# EAGLE design SparkFun_Digi_XBee_Regulated_Qwiic (EAGLE 9.6.2)
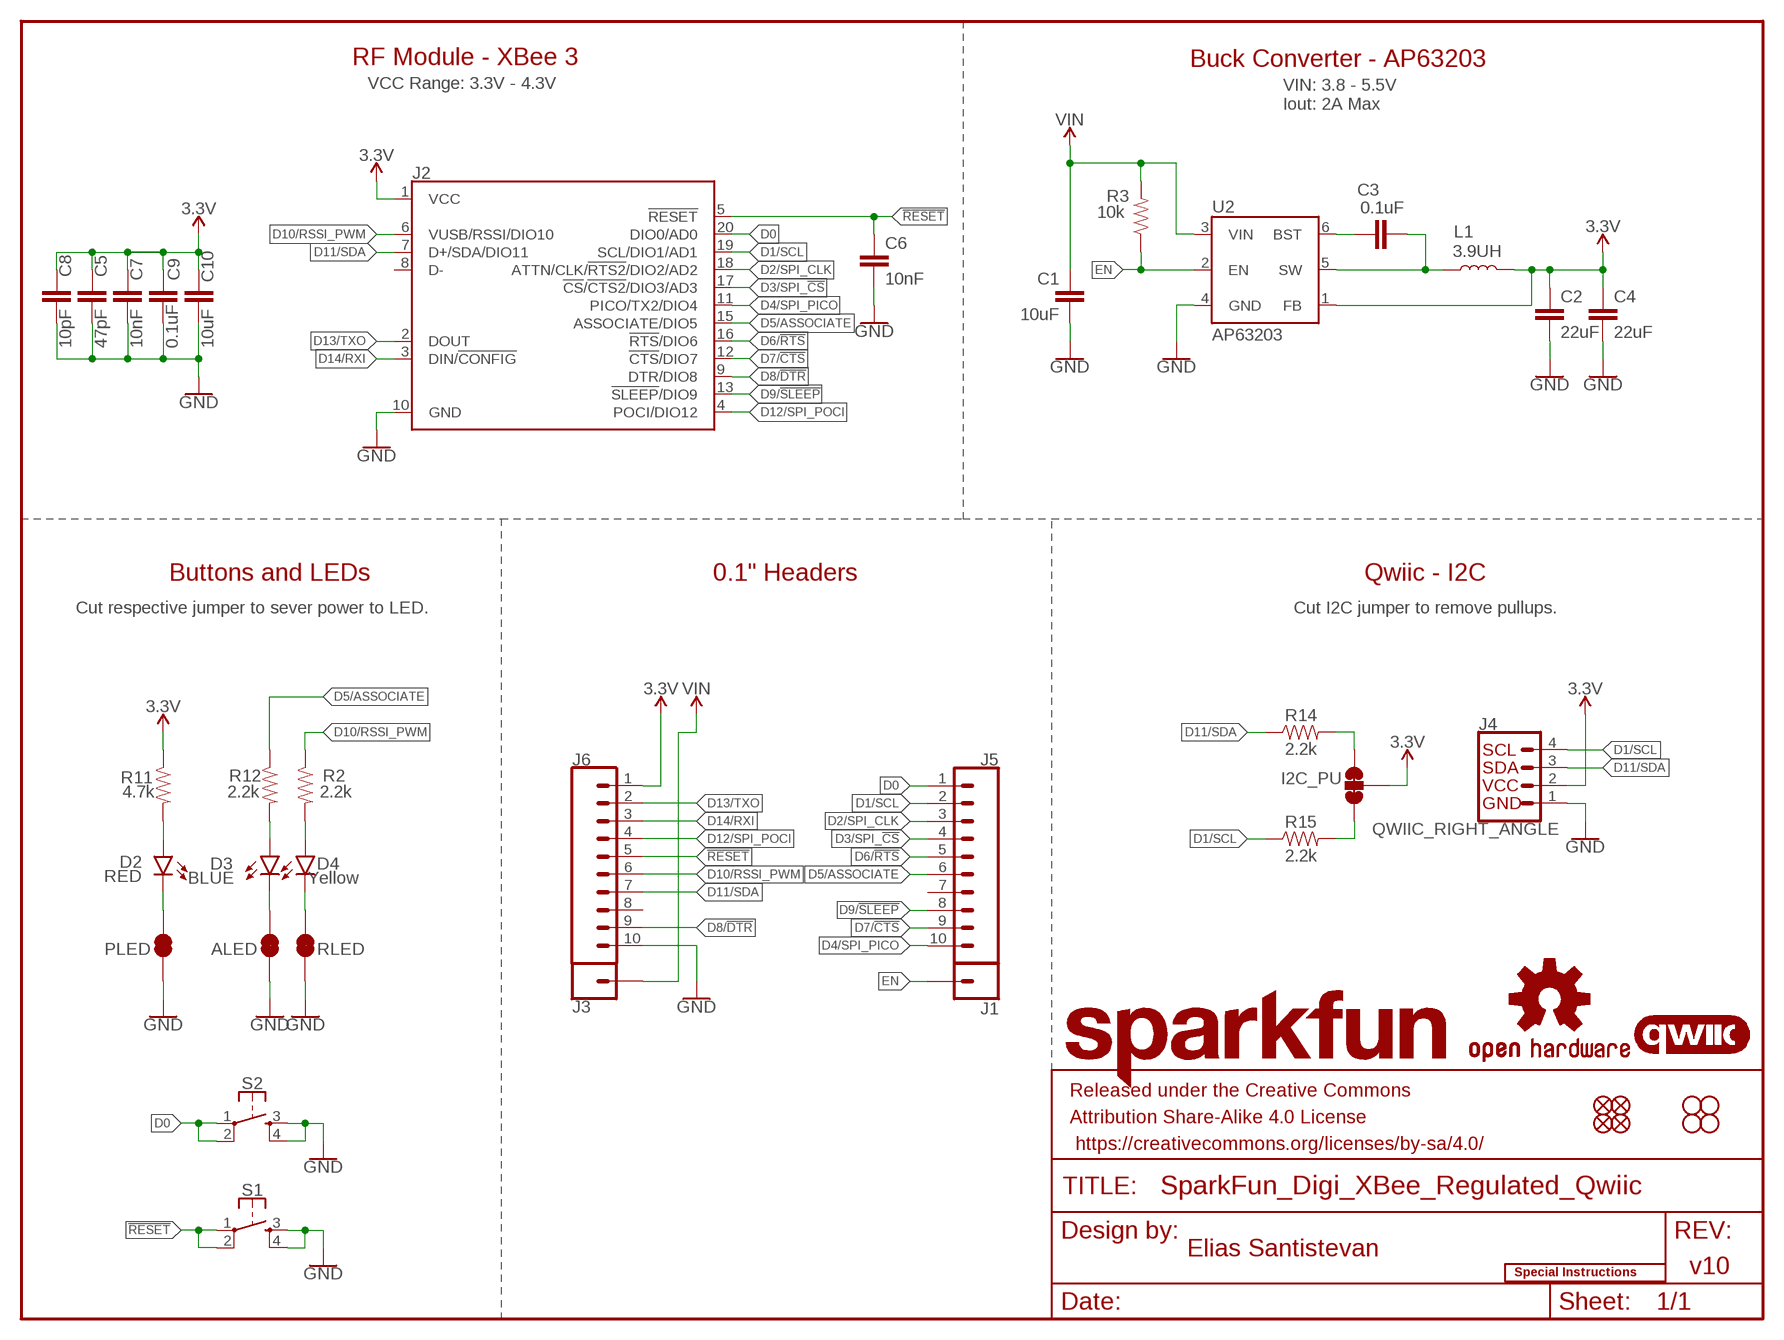
[diagram p0: schematic, sheet 1]

## Parts
ALED  JUMPER-SMT_2_NC_TRACE_SILK  [SMT-JUMPER_2_NC_TRACE_SILK]
C1  10uF  10UF-1210-50V-20%  [1210]
C2  22uF  22UF-0603-6.3V-20%  [0603]
C3  0.1uF  0.1UF-0603-25V-5%  [0603]
C4  22uF  22UF-0603-6.3V-20%  [0603]
C5  47pF  47PF-0603-50V-5%  [0603]
C6  10nF  10NF-0603-50V-10%  [0603]
C7  10nF  10NF-0603-50V-10%  [0603]
C8  10pF  10PF-0603-50V-5%  [0603]
C9  0.1uF  0.1UF-0603-25V-(+80/-20%)  [0603]
C10  10uF  10UF-0603-6.3V-20%  [0603]
D2  RED  LED-RED_0603-KB  [LED-0603]
D3  BLUE  LED-BLUE0603  [LED-0603]
D4  Yellow  LED-YELLOW0603  [LED-0603]
FD1  FIDUCIAL1X2  [FIDUCIAL-1X2]
FD2  FIDUCIAL1X2  [FIDUCIAL-1X2]
FD3  FIDUCIAL1X2  [FIDUCIAL-1X2]
FD4  FIDUCIAL1X2  [FIDUCIAL-1X2]
FRAME2  FRAME-LETTER  [CREATIVE_COMMONS]
H1  STAND-OFFTIGHT  [STAND-OFF-TIGHT]
H2  STAND-OFFTIGHT  [STAND-OFF-TIGHT]
H3  STAND-OFFTIGHT  [STAND-OFF-TIGHT]
H4  STAND-OFFTIGHT  [STAND-OFF-TIGHT]
I2C_PU  JUMPER-SMT_3_2-NC_TRACE_SILK  [SMT-JUMPER_3_2-NC_TRACE_SILK]
J1  CONN_01PTH_NO_SILK_STAND  [1X01_NO_SILK_STAND]
J2  XBEE_UPDATEXBEE_SMD  [XBEE3-SMD]
J3  CONN_01PTH_NO_SILK_STAND  [1X01_NO_SILK_STAND]
J4  QWIIC_RIGHT_ANGLE  QWIIC_CONNECTORJS-1MM  [JST04_1MM_RA]
J5  CONN_10NO_SILK_PTH_FEMALE  [1X10_NO_SILK]
J6  CONN_10NO_SILK_PTH_FEMALE  [1X10_NO_SILK]
L1  3.9UH  [INDUCTOR_3.9UH]
LOGO1  SPECIAL_INSTRUCTIONS-ORDERING  [ORDERING_INSTRUCTIONS]
LOGO2  OSHW-LOGOS  [OSHW-LOGO-S]
LOGO3  QWIIC_LOGO_4MM  [QWIIC_4MM]
LOGO4  SFE_LOGO_NAMEBLANK  [BLANK]
PLED  JUMPER-SMT_2_NC_TRACE_SILK  [SMT-JUMPER_2_NC_TRACE_SILK]
R2  2.2k  2.2KOHM-0603-1/10W-1%  [0603]
R3  10k  10KOHM-0603-1/10W-1%  [0603]
R11  4.7k  4.7KOHM-0603-1/10W-1%  [0603]
R12  2.2k  2.2KOHM-0603-1/10W-1%  [0603]
R14  2.2k  2.2KOHM-0603-1/10W-1%  [0603]
R15  2.2k  2.2KOHM-0603-1/10W-1%  [0603]
RLED  JUMPER-SMT_2_NC_TRACE_SILK  [SMT-JUMPER_2_NC_TRACE_SILK]
S1  MOMENTARY-SWITCH-SPST-2-SMD-5.2MM-TALL  [TACTILE_SWITCH_SMD_5.2MM]
S2  MOMENTARY-SWITCH-SPST-2-SMD-5.2MM-TALL  [TACTILE_SWITCH_SMD_5.2MM]
U2  AP63203  [SOT23-6]

## Nets
3.3V: C2.1 C4.1 C5.1 C7.1 C8.1 C9.1 C10.1 I2C_PU.2 J2.1(VCC) J4.2 J6.1 L1.P$2 R11.1 U2.1(FB)
!RESET!: C6.1 J2.5(!RESET!) J6.5 S1.1 S1.2
D0: J2.20(DIO0/AD0) J5.1 S2.1 S2.2
D1/SCL: J2.19(SCL/DIO1/AD1) J4.4 J5.2 R15.1
D2/SPI_CLK: J2.18(ATTN/CLK/!RTS2!/DIO2/AD2) J5.3
D3/SPI_!CS!: J2.17(!CS!/!CTS2!/DIO3/AD3) J5.4
D4/SPI_PICO: J2.11(PICO/TX2/DIO4) J5.10
D5/ASSOCIATE: J2.15(ASSOCIATE/DIO5) J5.6 R12.1
D6/!RTS!: J2.16(!RTS!/DIO6) J5.5
D7/!CTS!: J2.12(!CTS!/DIO7) J5.9
D8/!DTR!: J2.9(DTR/DIO8) J6.9
D9/!SLEEP!: J2.13(!SLEEP!/DIO9) J5.8
D10/RSSI_PWM: J2.6(VUSB/RSSI/DIO10) J6.6 R2.1
D11/SDA: J2.7(D+/SDA/DIO11) J4.3 J6.7 R14.1
D12/SPI_POCI: J2.4(POCI/DIO12) J6.4
D13/TXO: J2.2(DOUT) J6.2
D14/RXI: J2.3(DIN/!CONFIG!) J6.3
EN: J1.1 R3.1 U2.2(EN)
GND: ALED.1 C1.2 C2.2 C4.2 C5.2 C6.2 C7.2 C8.2 C9.2 C10.2 J2.10(GND) J4.1 J6.10 PLED.1 RLED.1 S1.3 S1.4 S2.3 S2.4 U2.4(GND)
N$1: C3.1 U2.6(BST)
N$2: D4.A R2.2
N$3: D4.C RLED.2
N$7: D2.A R11.2
N$8: C3.2 L1.P$1 U2.5(SW)
N$11: I2C_PU.3 R14.2
N$12: D3.A R12.2
N$13: I2C_PU.1 R15.2
N$21: ALED.2 D3.C
N$23: D2.C PLED.2
VIN: C1.1 J3.1 R3.2 U2.3(VIN)
Unconnected: J2.8(D-) J5.7 J6.8

## Notes on the sheet
- RF Module - XBee 3 | Buck Converter - AP63203
- VCC Range: 3.3V - 4.3V
- VIN: 3.8 - 5.5V
  Iout: 2A Max
- Buttons and LEDs | 0.1" Headers | Qwiic - I2C
- Cut respective jumper to sever power to LED. | Cut I2C jumper to remove pullups.
- Elias Santistevan
- v10

## Library data of the parts
ALED PLED RLED = SparkFun-Jumpers:JUMPER-SMT_2_NC_TRACE: Normally closed trace jumper This jumper has a trace between two pads so it's normally closed (NC). Use a razor knife to open the connection. For best results follow the IPC guidelines for cutting traces: Cutout at least 0.063 mm (0.005 in). Remove all loose material to clean up the cut area. Seal the cut with an approved epoxy. Reapply solder to reclose the connection.
C1 = SparkFun-Capacitors:10UF: 10.0µF ceramic capacitors A capacitor is a passive two-terminal electrical component used to store electrical energy temporarily in an electric field.; PROD_ID: CAP-09824
C2 C4 = SparkFun-Capacitors:22UF: 22µF ceramic capacitors A capacitor is a passive two-terminal electrical component used to store electrical energy temporarily in an electric field.; PROD_ID: CAP-14464
C3 = SparkFun-Capacitors:0.1UF: 0.1µF ceramic capacitors A capacitor is a passive two-terminal electrical component used to store electrical energy temporarily in an electric field.; PROD_ID: CAP-08604
C5 = SparkFun-Capacitors:47PF: 47pF ceramic capacitors A capacitor is a passive two-terminal electrical component used to store electrical energy temporarily in an electric field.; PROD_ID: CAP-08913
C6 C7 = SparkFun-Capacitors:10NF: 0.01uF/10nF/10,000pF ceramic capacitors A capacitor is a passive two-terminal electrical component used to store electrical energy temporarily in an electric field. CAP-09321; PROD_ID: CAP-00867
C8 = SparkFun-Capacitors:10PF: 10pF ceramic capacitors A capacitor is a passive two-terminal electrical component used to store electrical energy temporarily in an electric field.; PROD_ID: CAP-11812
C9 = SparkFun-Capacitors:0.1UF: 0.1µF ceramic capacitors A capacitor is a passive two-terminal electrical component used to store electrical energy temporarily in an electric field.; PROD_ID: CAP-00810
C10 = SparkFun-Capacitors:10UF: 10.0µF ceramic capacitors A capacitor is a passive two-terminal electrical component used to store electrical energy temporarily in an electric field.; PROD_ID: CAP-11015
D2 = SparkFun-LED:LED-RED: Red SMD LED Used in manufacturing of most products at SparkFun Packages: 0603 - KB - KingBright (DIO-17976) SMD 0603 package [Datasheet] <https://www.kingbrightusa.com/images/catalog/SPEC/APT1608SURCK.pdf> 0603 - (DIO-00819, has gone EOL) SMD 0603 package 0603 SMART - SMD 0603 SMART package ( more efficient and expensive)[Product Link] <http://www.osram-os.com/Graphics/XPic2/00077099_0.pdf> 1206 - SMD1206 package [Product Link] <https://www.sparkfun.com/datasheets/DevTools/LilyPad/Q150OVS4.pdff> SparkFun Products: Pro Mini 328 -5V <https://www.sparkfun.com/products/821> RedBoard <https://www.sparkfun.com/products/12757> IOIO-OTG <https://www.sparkfun.com/products/13613>; PROD_ID: DIO-17976
D3 = SparkFun-LED:LED-BLUE: Blue SMD LED Used in manufacturing of various products at SparkFun Packages: 0603 - SMD 0603 package [Product Link] <http://www.digikey.com/product-detail/en/SMLE12BC7TT86/511-1589-2-ND/1641808> 1206 - SMD1206 package [Product Link] <http://www.digikey.com/product-detail/en/lite-on-inc/LTST-C150TBKT/160-1643-1-ND/573584> SparkFun Products: ESP8266 Thing-Dev Board <https://www.sparkfun.com/products/13711> RedBoard <https://www.sparkfun.com/products/12757>; PROD_ID: DIO-08575
D4 = SparkFun-LED:LED-YELLOW: Yellow SMD LED Used in manufacturing several products at SparkFun. Packages: 0603 - SMD 0603 package[Product Link] <http://www.kingbrightusa.com/product.asp?catalog_name=LED&product_id=APT1608SYCK> 0603 -SMART - SMART SMD 0603 package (more efficient/more expensive) [Product Link] <http://www.osram-os.com/osram_os/en/products/product-catalog/led-light-emitting-diodes/smartled-0603/ly-l29k/index.jsp> LilyPad - SMD1206 package[Product Datasheet] <https://www.sparkfun.com/datasheets/DevTools/LilyPad/Q150YUS4.pdf> SparkFun Products: Blynk Board <https://www.sparkfun.com/products/13794> IOIO-OTG <https://www.sparkfun.com/products/13613> XBee Explorer Serial <https://www.sparkfun.com/products/13225>; PROD_ID: DIO-09003
FD1-FD4 = SparkFun-Aesthetics:FIDUCIAL: Fiducial Alignment Points Point-of-reference for pick-and-place machines and other optical instruments.
FRAME2 = SparkFun-Aesthetics:FRAME-LETTER: Schematic Frame - Letter Standard 8.5x11 US Letter frame
H1-H4 = SparkFun-Hardware:STAND-OFF: Stand Off Drill holes for mechanically mounting via screws, standoffs, etc. Note: Use the keepout ring to avoid running the screw head into surrounding components. Variant Overviews STAND-OFF - Mechanical footprint for a #4 phillips button head screw. STAND-OFF-TIGHT - Mechanical footprint for a #4 phillips button head screw, Example SparkFun Products Screw - Phillips Head (1/4", 4-40, 10 pack) <https://www.sparkfun.com/products/10453> (PRT-10453) Screw - Phillips Head (1/2", 4-40, 10 pack) <https://www.sparkfun.com/products/10452> (PRT-10452) Screw - Phillips Head (3/4", 4-40, 10 pack) <https://www.sparkfun.com/products/10451> (PRT-10451) Screw - Phillips Head (1", 4-40, 10 pack) <https://www.sparkfun.com/products/10450> (PRT-10450)
I2C_PU = SparkFun-Jumpers:JUMPER-SMT_3_2-NC_TRACE: Normally closed trace jumper (2 of 2 connections) This jumper has a trace between all three pads so they are normally closed (NC). Use a razor knife to open the connection(s). For best results follow the IPC guidelines for cutting traces: Cutout at least 0.063 mm (0.005 in). Remove all loose material to clean up the cut area. Seal the cut with an approved epoxy. Reapply solder to reclose the connection(s).
J1 J3 = SparkFun-Connectors:CONN_01: Single connection point. Often used as Generic Header-pin footprint for 0.1 inch spaced/style header connections On any of the 0.1 inch spaced packages, you can populate with these: Break Away Headers - Straight <https://www.sparkfun.com/products/116> (PRT-00116) Break Away Male Headers - Right Angle <https://www.sparkfun.com/products/553> (PRT-00553) Female Headers <https://www.sparkfun.com/products/115> (PRT-00115) Break Away Headers - Machine Pin <https://www.sparkfun.com/products/117> (PRT-00117) Break Away Female Headers - Swiss Machine Pin <https://www.sparkfun.com/products/743> (PRT-00743) This device is also useful as a general connection point to wire up your design to another part of your project. Our various solder wires solder well into these plated through hole pads. Hook-Up Wire - Assortment (Stranded, 22 AWG) <https://www.sparkfun.com/products/11375> (PRT-11375) Hook-Up Wire - Assortment (Solid Core, 22 AWG) <https://www.sparkfun.com/products/11367> (PRT-11367) View the entire wire category on our website here <https://www.sparkfun.com/categories/141> Special notes: SMTSO-256-ET is a "flush mount" nut for a 4-40 screw. We mostly use this on specialty testbeds; it is a nice way to connect hardware to your PCB at an adjustable hieght. Also note, the SNAP packages are for using a snappable style connector. We sell a baggie of snaps and they are also used on two LilyPad designs: Snap Assortment - 30 pack (male and female) <https://www.sparkfun.com/products/11347> (DEV-11347) LilyPad Arduino SimpleSnap <https://www.sparkfun.com/products/10941> (DEV-10941) LilyPad SimpleSnap Protoboard <https://www.sparkfun.com/products/10940> (DEV-10940)
J2 = xbee_smart_modem:XBEE_UPDATE: XBee 3 Cat 1 Smart Modem
J4 = SparkFun-Connectors:QWIIC_CONNECTOR: SparkFun I2C Standard Qwiic Connector An SMD 1mm pitch JST connector makes it easy and quick (get it? Qwiic?) to connect I2C devices to each other. The Qwiic system <http://www.sparkfun.com/qwiic> enables fast and solderless connection between popular platforms and various sensors and actuators. We carry 200mm <https://www.sparkfun.com/products/14204>, 100mm <https://www.sparkfun.com/products/14205>, 50mm <https://www.sparkfun.com/products/14206>, and breadboard friendly <https://www.sparkfun.com/products/14207> Qwiic cables. We also offer 10 pcs strips <https://www.sparkfun.com/products/14323> the SMD connectors.; PROD_ID: CONN-13694
J5 J6 = SparkFun-Connectors:CONN_10: Multi connection point. Often used as Generic Header-pin footprint for 0.1 inch spaced/style header connections On any of the 0.1 inch spaced packages, you can populate with these: Break Away Headers - Straight <https://www.sparkfun.com/products/116> (PRT-00116) Break Away Male Headers - Right Angle <https://www.sparkfun.com/products/553> (PRT-00553) Female Headers <https://www.sparkfun.com/products/115> (PRT-00115) Break Away Headers - Machine Pin <https://www.sparkfun.com/products/117> (PRT-00117) Break Away Female Headers - Swiss Machine Pin <https://www.sparkfun.com/products/743> (PRT-00743) Arduino Stackable Header - 10 Pin <https://www.sparkfun.com/products/11376> (PRT-11376) For SCREWTERMINALS and SPRING TERMINALS visit here: Screw Terimnals on SparkFun.com <https://www.sparkfun.com/search/results?term=Screw+Terminals> (5mm/3.5mm/2.54mm spacing) This device is also useful as a general connection point to wire up your design to another part of your project. Our various solder wires solder well into these plated through hole pads. Hook-Up Wire - Assortment (Stranded, 22 AWG) <https://www.sparkfun.com/products/11375> (PRT-11375) Hook-Up Wire - Assortment (Solid Core, 22 AWG) <https://www.sparkfun.com/products/11367> (PRT-11367) View the entire wire category on our website here <https://www.sparkfun.com/categories/141> Special notes: Molex polarized connector foot print use with SKU : PRT-08231 with associated crimp pins and housings. 1MM SMD Version SKU: PRT-10208 NOTES ON THE VARIANTS LOCK and LOCK_LONGPADS... This footprint was designed to help hold the alignment of a through-hole component (i.e. 6-pin header) while soldering it into place. You may notice that each hole has been shifted either up or down by 0.005 of an inch from it's more standard position (which is a perfectly straight line). This slight alteration caused the pins (the squares in the middle) to touch the edges of the holes. Because they are alternating, it causes a "brace" to hold the component in place. 0.005 has proven to be the perfect amount of "off-center" position when using our standard breakaway headers. Although looks a little odd when you look at the bare footprint, once you have a header in there, the alteration is very hard to notice. Also,if you push a header all the way into place, it is covered up entirely on the bottom side.
L1 = SparkFun-Coils:3.9UH: Würth's Electronik 3.9uH Inductor Characteristics 3.9uH 2.4A Current Rating 2.8A Saturation Inductance Frequency: 100kHzd AEC-Q200 Certified 5mm x 5mm Package 30% tolerance; PROD_ID: NDUC-18014
LOGO1 = SparkFun-Aesthetics:SPECIAL_INSTRUCTIONS: Special Ordering/Production Instructions Alert Symbol for special PCB ordering instructions or unique production process warnings. Ordering Instructions Production Instructions Types of information that should be added to box: Copper weight Soldermask color Silk color PCB thickness Number of layers PCB Standard: 1.6mm FR4 1 oz copper immersion silver plating red soldermask white silkscreen Types of information that should be added to box: Special wash requirements Depaneling instructions Humidification Glue curing Default text settings: 0.07 inch 9% ratio 50% line distance
LOGO2 = SparkFun-Aesthetics:OSHW-LOGO: Open-Source Hardware (OSHW) Logo This logo indicates the piece of hardware it is found on incorporates a OSHW license and/or adheres to the definition of open source hardware found here: http://freedomdefined.org/OSHW
LOGO3 = SparkFun-Aesthetics:QWIIC_LOGO: Qwiic Logos for placement on schematic and PCB. The 5.5mm silk logo is best for placing next to Qwiic connector.
LOGO4 = SparkFun-Aesthetics:SFE_LOGO_NAME: SparkFun Font Logo This is the SparkFun name logo. The logo on the schematic will always be the same size; the package variant is the height of the flame part of the logo (or the height the flame would be, if it were drawn). Default layer for the logo on the board is tSilk.
R2 R12 R14 R15 = SparkFun-Resistors:2.2KOHM: 2.2kΩ resistor A resistor is a passive two-terminal electrical component that implements electrical resistance as a circuit element. Resistors act to reduce current flow, and, at the same time, act to lower voltage levels within circuits. - Wikipedia; PROD_ID: RES-08272
R3 = SparkFun-Resistors:10KOHM: 10kΩ resistor A resistor is a passive two-terminal electrical component that implements electrical resistance as a circuit element. Resistors act to reduce current flow, and, at the same time, act to lower voltage levels within circuits. - Wikipedia; PROD_ID: RES-00824
R11 = SparkFun-Resistors:4.7KOHM: 4.7kΩ resistor A resistor is a passive two-terminal electrical component that implements electrical resistance as a circuit element. Resistors act to reduce current flow, and, at the same time, act to lower voltage levels within circuits. - Wikipedia; PROD_ID: RES-07857
S1 S2 = SparkFun-Switches:MOMENTARY-SWITCH-SPST-2: Momentary Switch (Pushbutton) - SPST - Two Circuits Normally-open (NO) SPST momentary switches (buttons, pushbuttons). Schematic symbol includes two switch circuits. Variants SMD-4.6MMX2.8MM - 4.60mm x 2.80mm Tactile Momentary Button Switch - Used on SparkFun Pro Micro - RP2040 <https://www.sparkfun.com/products/17717> SMD-5.2MM - Mini Pushbutton Switch - SMD <https://www.sparkfun.com/products/8720> - Used on Arduino Pro Mini <https://www.sparkfun.com/products/11114>; PROD_ID: SWCH-14139
U2 = SparkFun-IC-Power:AP63203: Diodes Inc. AP63203 3.8V-32V input 3.3V Buck The AP63200/AP63201/AP63203/AP63205 is a 2A, synchronous buck converter with a wide input voltage range of 3.8V to 32V and fully integrates a 125mΩ high-side power MOSFET and a 68mΩ lowside power MOSFET to provide high-efficiency step-down DC/DC conversion; PROD_ID: VREG-15244

## Net classes
1 POWER: width 0.559 mm, drill 0.305 mm
2 Diff pairs: width 0.203 mm, drill 0.305 mm, clearance 0.152 mm

## Board
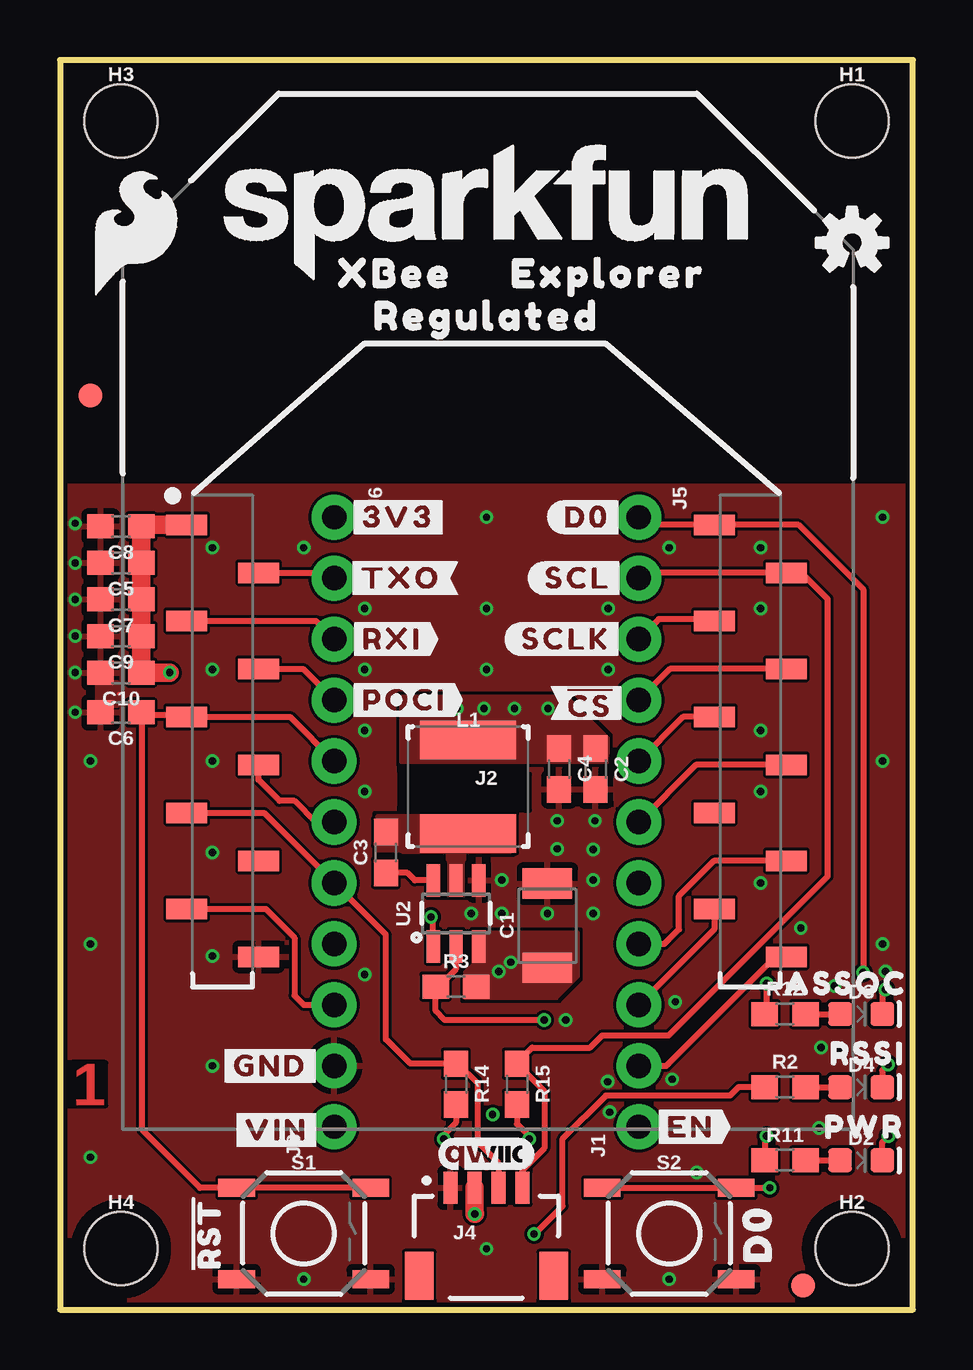
[diagram p1: board, top side]
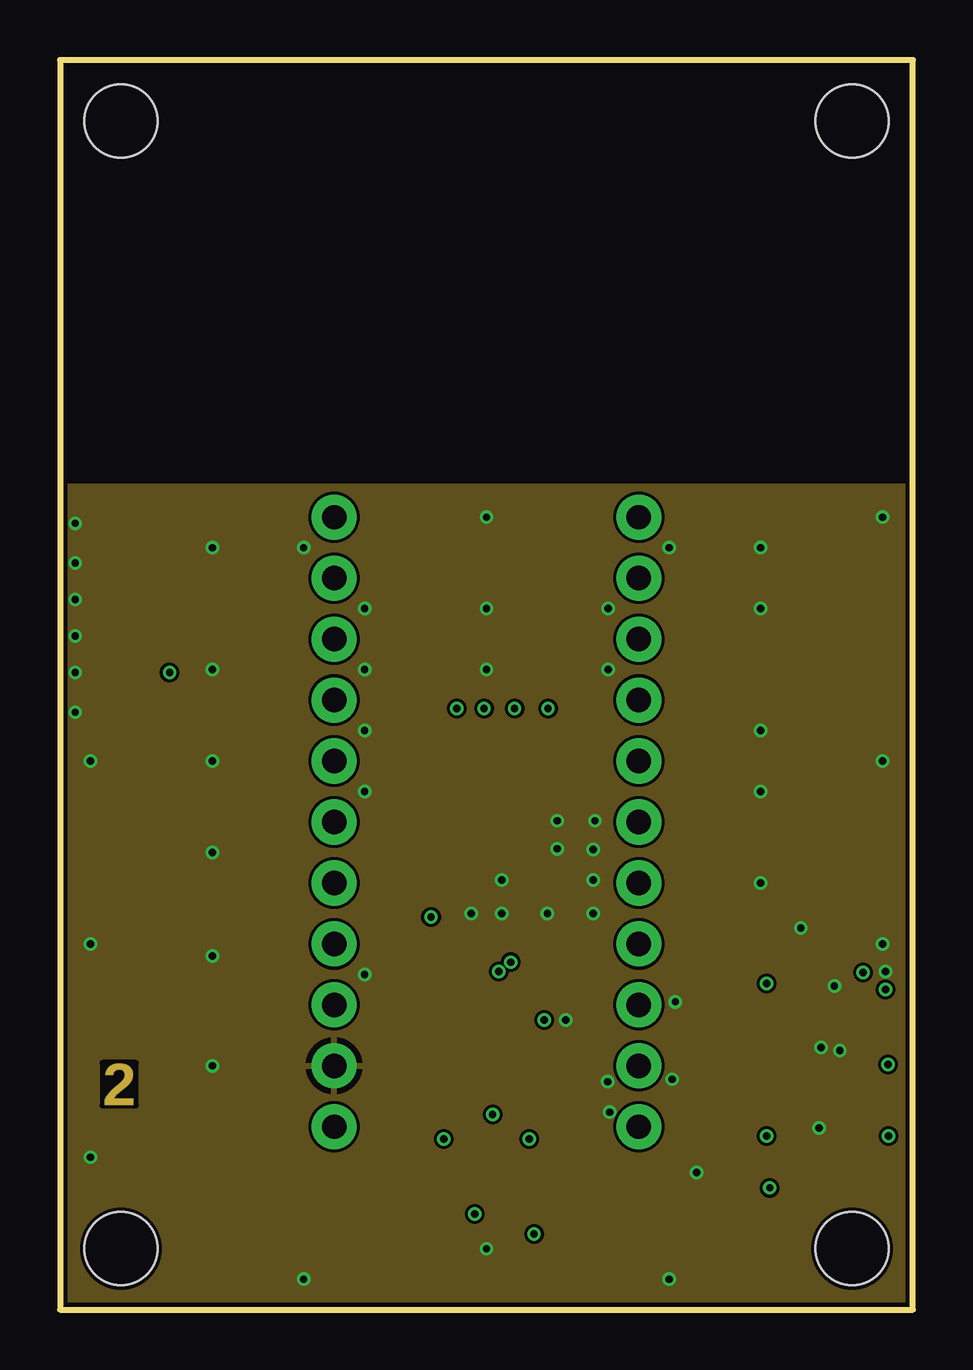
[diagram p2: board, inner layer Route2]
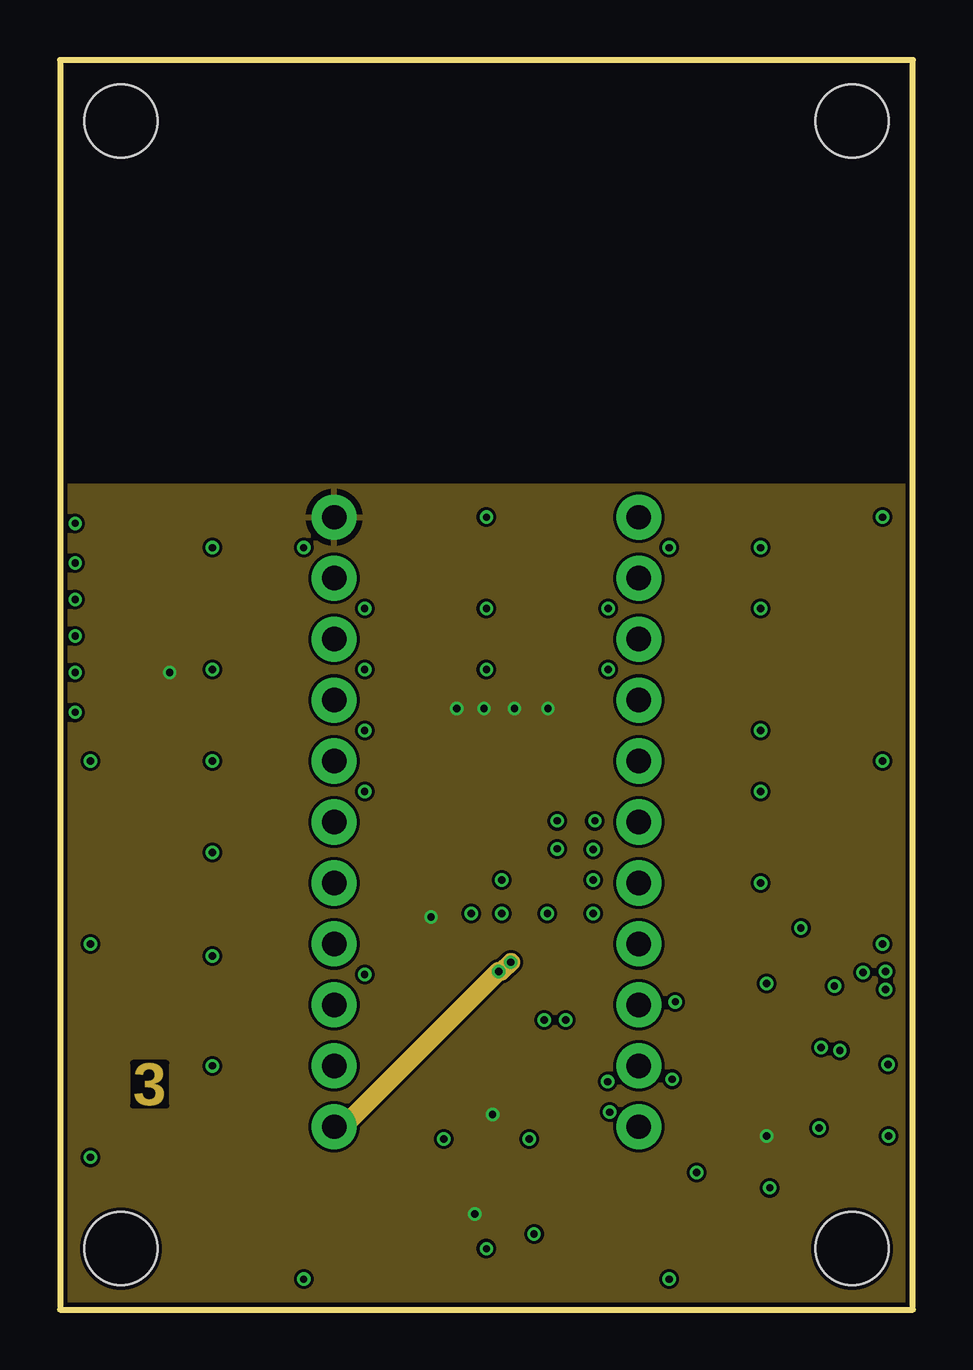
[diagram p3: board, inner layer Route15]
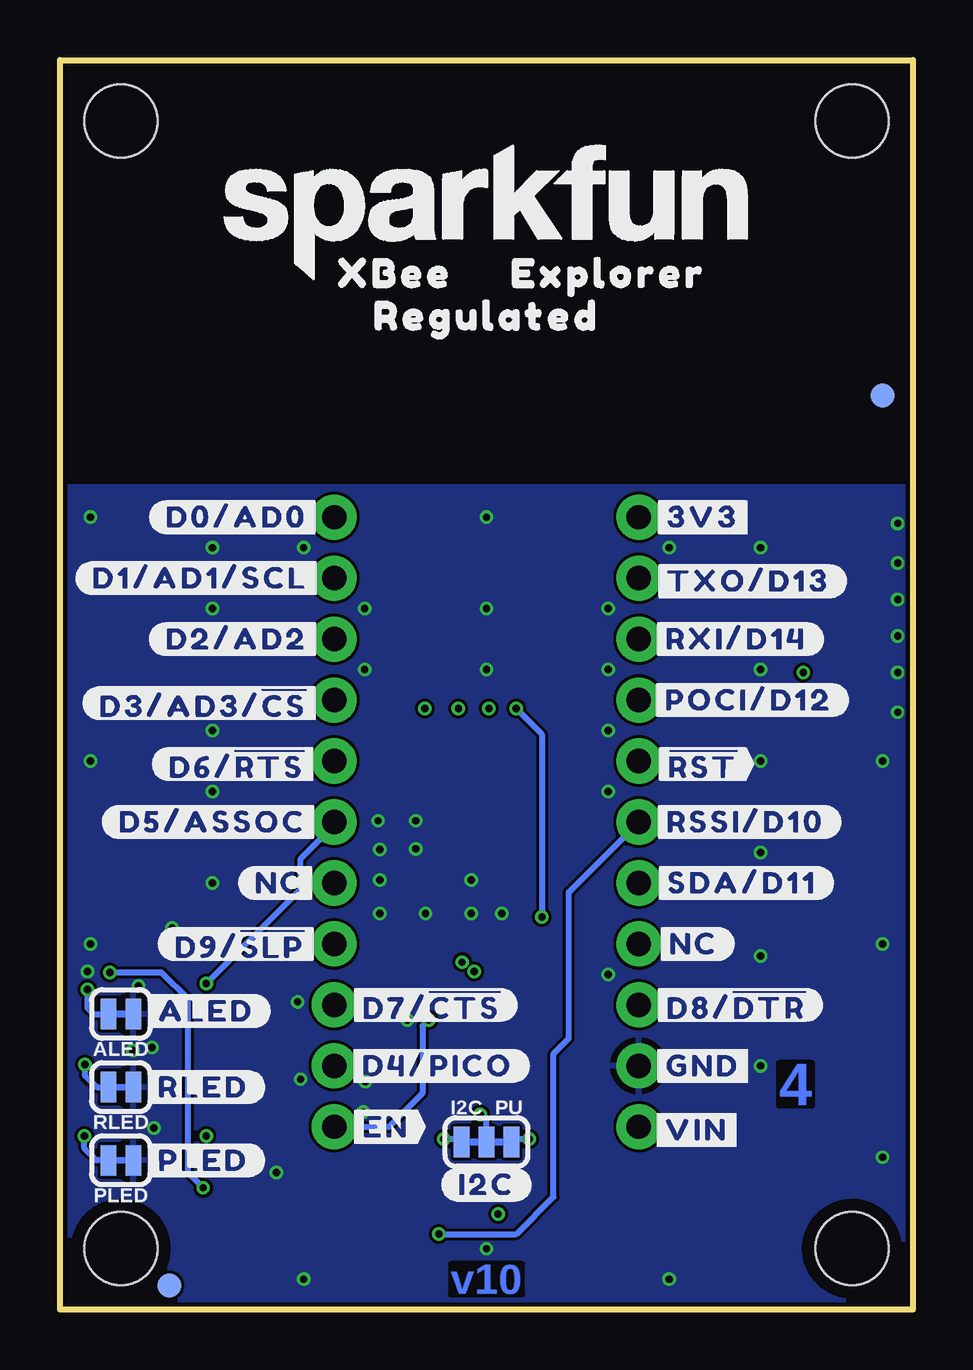
[diagram p4: board, bottom side, seen from below]

Size 35.56 x 52.07 mm. Coordinates in mm from the lower left corner, seen from the top.
Outline: 0,52.07 0,0 35.56,0 35.56,52.07 0,52.07
Copper layers (1*2*15*16): Top 0.035559375mm / dielectric 0.47751875mm / Route2 0.035559375mm / dielectric 0.47751875mm / Route15 0.035559375mm / dielectric 0.47751875mm / Bottom 0.035559375mm
Design rules "SparkFun-4-Layer-Minimum-JLCPCB": minimum track width 5mil, minimum drill 0.2mm, track to track 5mil, track to pad 5mil, pad to pad 5mil, via to via 5mil, smd to smd 5mil, copper to edge 7mil, drill to drill 7mil, minimum pad ring 5mil, minimum via ring 5mil, stop-mask expansion 2.5mil, vias tented up to drill 25mil, thermal gap 10mil
tRestrict: area 14.2,21 to 14.4,22.4; area 19.4,20.8 to 19.6,22.3

### Footprints (pad centres in the part's own frame; a part is rotated, then mirrored left to right if it is on the bottom)
SMT-JUMPER_2_NC_TRACE_SILK = smd 0.66 x 1.27: 1 -0.521,0; 2 0.521,0
1210 = smd 1.27 x 2.06: 1 -1.755,0; 2 1.755,0
0603 = smd 1.1 x 1: 1 -0.85,0; 2 0.85,0
LED-0603 = smd 1 x 1: A -0.877,0; C 0.877,0
FIDUCIAL-1X2 = smd 1 x 1: 1 0,0
STAND-OFF-TIGHT = hole 3.048: 0,0
SMT-JUMPER_3_2-NC_TRACE_SILK = smd 0.66 x 1.27: 1 -1.041,0; 2 0,0; 3 1.041,0
1X01_NO_SILK_STAND = drill 1.016 pad 1.88: 1 0,0
XBEE3-SMD = smd 1.7 x 0.85: 1 -12.5,11.11; 2 -9.5,9.11; 3 -12.5,7.11; 4 -9.5,5.11; 5 -12.5,3.11; 6 -9.5,1.11; 7 -12.5,-0.89; 8 -9.5,-2.89; 9 -12.5,-4.89; 10 -9.5,-6.89; 11 12.5,-6.89; 12 9.5,-4.89; 13 12.5,-2.89; 14 9.5,-0.89; 15 12.5,1.11; 16 9.5,3.11; 17 12.5,5.11; 18 9.5,7.11; 19 12.5,9.11; 20 9.5,11.11
JST04_1MM_RA = smd 0.6 x 1.35: 1 -1.5,0; 2 -0.5,0; 3 0.5,0; 4 1.5,0 | smd 1.2 x 2: NC1 2.8,-3.675; NC2 -2.8,-3.675
1X10_NO_SILK = drill 1.016 pad 1.88: 1 0,0; 2 2.54,0; 3 5.08,0; 4 7.62,0; 5 10.16,0; 6 12.7,0; 7 15.24,0; 8 17.78,0; 9 20.32,0; 10 22.86,0
INDUCTOR_3.9UH = smd 4 x 1.6: P$1 0,-2; P$2 0,1.9
TACTILE_SWITCH_SMD_5.2MM = smd 1.524 x 0.762: 1 -2.794,1.905; 2 2.794,1.905; 3 -2.794,-1.905; 4 2.794,-1.905
SOT23-6 = smd 0.55 x 1.35: 1 -0.95,-1.375; 2 0,-1.375; 3 0.95,-1.375; 4 0.95,1.375; 5 0,1.375; 6 -0.95,1.375

### Placement (x,y rotation side)
ALED  33.02,12.32 180 bottom
C1  20.32,16 90 top
C2  22.33,22.53 270 top
C3  13.59,19.05 90 top
C4  20.8,22.53 270 top
C5  2.54,31.11 180 top
C6  2.54,24.89 180 top
C7  2.54,29.59 180 top
C8  2.54,32.64 180 top
C9  2.54,28.07 180 top
C10  2.54,26.54 180 top
D2  33.4,6.22 0 top
D3  33.4,12.32 0 top
D4  33.4,9.27 0 top
FD1  1.27,38.1 0 top
FD2  1.27,38.1 0 bottom
FD3  30.99,1.02 0 top
FD4  30.99,1.02 0 bottom
FRAME2  -8.89,-27.94 0 top  (outside the outline)
H1  33.02,49.53 0 top
H2  33.02,2.54 0 top
H3  2.54,49.53 0 top
H4  2.54,2.54 0 top
I2C_PU  17.78,6.99 0 bottom
J1  24.13,7.62 90 top
J2  17.78,21.59 0 top
J3  11.43,7.62 90 top
J4  17.78,5.08 0 top
J5  24.13,33.02 270 top
J6  11.43,33.02 270 top
L1  17.02,21.84 0 top
LOGO1  46.99,52.07 0 top  (outside the outline)
LOGO2  33.02,44.45 0 top
LOGO3  17.78,6.48 0 top
LOGO4  -8.89,-27.94 0 top  (outside the outline)
PLED  33.02,6.22 180 bottom
R2  30.23,9.27 0 top
R3  16.51,13.46 0 top
R11  30.23,6.22 0 top
R12  30.23,12.32 0 top
R14  16.51,9.4 270 top
R15  19.05,9.4 270 top
RLED  33.02,9.27 180 bottom
S1  10.16,3.17 0 top
S2  25.4,3.17 0 top
U2  16.51,16.51 0 top
U$1  [#GND#0]  8.76,10.16 0 top
U$2  [SFE_LOGO_NAME_.2]  17.78,45.72 0 top
U$3  [#EN#17]  21.97,7.62 0 bottom
U$4  [#NC#1]  9.14,15.24 0 bottom
U$5  [#NC#3]  26.42,17.78 0 bottom
U$6  [#EN#17]  26.29,7.62 0 top
U$7  [#D7##CTS##26]  20.07,12.7 0 bottom
U$8  [#D0#AD0#18]  28.19,33.02 0 bottom
U$9  [#3V3#1]  14.1,33.02 0 top
U$10  [#D4#PICO#25]  19.81,10.16 0 bottom
U$11  [#RLED#22]  29.59,9.27 0 bottom
U$12  [#GND#0]  8.76,10.16 0 bottom
U$13  [#D8##DTR##27]  7.37,12.7 0 bottom
U$14  [#RSSI#D10#17]  6.98,20.32 0 bottom
U$15  [#SDA#D11#9]  7.11,17.78 0 bottom
U$16  [##RST##15]  8.76,22.73 0 bottom
U$17  [#POCI#D12#24]  6.86,25.4 0 bottom
U$18  [#RXI#D14#15]  7.37,27.94 0 bottom
U$19  [#D2#AD2#19]  28.19,27.94 0 bottom
U$20  [#D6##RTS##25]  28.19,22.73 0 bottom
U$21  [#TXO#8]  14.22,30.48 0 top
U$22  [#TXO#D13#13]  6.86,30.35 0 bottom
U$23  [EXPLORER1344]  12.7,43.18 0 bottom
U$24  [REGULATED1343]  17.78,41.4 0 bottom
U$25  [XBEE340]  21.59,43.18 0 bottom
U$26  [#I2C#33]  17.78,5.21 0 bottom
U$27  [#RXI#7]  13.84,27.94 0 top
U$28  [XBEE340]  13.97,43.18 0 top
U$29  [REGULATED1343]  17.78,41.4 0 top
U$30  [#RST#30]  6.1,3.17 90 top
U$31  [#D0#3]  21.97,33.02 0 top
U$32  [#D1#AD1#SCL#8]  29.72,30.48 0 bottom
U$33  [EXPLORER1344]  22.86,43.18 0 top
U$34  [#D3#AD3##CS##23]  29.59,25.27 0 bottom
U$35  [#D5#ASSOC#25]  29.21,20.32 0 bottom
U$36  [#D9##SLP##28]  28.07,15.24 0 bottom
U$40  [D03]  29.08,3.17 90 top
U$42  [PWR26]  33.53,7.62 0 top
U$43  [ASSOC27]  32.77,13.59 0 top
U$44  [#3V3#1]  8.76,33.02 0 bottom
U$45  [#POCI#32]  14.35,25.4 0 top
U$46  [#VIN#4]  9.02,7.49 0 bottom
U$49  [#ALED#21]  29.46,12.45 0 bottom
U$52  [#PLED#20]  29.59,6.22 0 bottom
U$59  [##CS##26]  22.1,25.27 0 top
U$60  [#SCLK#33]  21.08,27.94 0 top
U$61  [SFE_LOGO_FLAME_.2]  3.17,44.83 0 top
U$62  [RSSI31]  33.66,10.67 0 top
U$63  [SFE_LOGO_NAME_.2]  17.78,45.72 0 bottom
U$64  [#SCL#9]  21.59,30.48 0 top
U$65  [#D0#3]  21.97,33.02 0 top
U$66  [#VIN#4]  9.02,7.49 0 top

### Tracks (layer width: path | path; a pad name or v marks a point on that pad's centre or on a via)
3.3V  (via drill 0.3)
  Top 0.254: v29.46,7.24 29.38,7.15 R11.1 | v15.47,16.36 15.56,16.27 U2.1
  Top 0.762: J4.2 17.28,4 v17.3,3.99 | J2.1 3.45,32.7 C8.1 C5.1 C7.1 C9.1 C10.1 v4.57,26.54
  Bottom 0.254: v16.54,25.04 15.47,23.98 v15.47,16.36 | I2C_PU.2 17.78,7.87 v18.03,8.13
  other vias: 17.68,25.04 18.95,25.04 20.35,25.04
  pour Top (isolate 0.305, no thermals): 22.83,22.78 14.22,22.78 14.22,25.58 21.11,25.58 22.83,23.85
  pour Route15 (isolate 0.127, rank 3): 0,0 35.56,0 35.56,34.29 0,34.29
!RESET!
  Top 0.254: J6.5 9.59,24.7 J2.5 5.21,24.77 3.52,24.77 C6.1 3.43,24.85 3.43,7.49 5.84,5.08 S1.1 S1.2
D0  (via drill 0.3)
  Top 0.254: J5.1 24.45,32.7 J2.20 30.8,32.7 33.48,30.02 v33.48,14.05 | S2.1 S2.2 v29.59,5.08
  Bottom 0.254: v29.59,5.08 30.23,5.71 30.23,12.95 31.32,14.05 v33.48,14.05
D1/SCL
  Top 0.254: J5.2 24.35,30.7 J2.19 30.91,30.7 32,29.61 32,18.06 25.38,11.43 22.61,11.43 22.1,10.92 19.68,10.92 19.05,10.29 R15.1 20.19,9.11 20.19,6.73 19.28,5.82 J4.4
D2/SPI_CLK
  Top 0.254: J2.18 27.2,28.78 24.97,28.78 J5.3
D3/SPI_!CS!
  Top 0.254: J5.4 25.43,26.7 J2.17
D4/SPI_PICO
  Top 0.254: J5.10 25.27,10.16 29.81,14.7 J2.11
D5/ASSOCIATE  (via drill 0.3)
  Top 0.254: J2.15 26.51,22.7 J5.6 | R12.1 29.46,12.41 v29.46,13.59
  Bottom 0.254: J5.6 24.07,20.26 25.53,18.8 25.53,17.53 v29.46,13.59
D6/!RTS!
  Top 0.254: J5.5 25.97,24.7 J2.16
D7/!CTS!
  Top 0.254: J2.12 27.28,15.85 J5.9
D8/!DTR!
  Top 0.254: J2.9 8.57,16.7 9.78,15.49 9.78,13.08 10.16,12.7 J6.9
D9/!SLEEP!
  Top 0.254: J2.13 27.26,18.7 25.81,17.25 25.81,15.85 25.2,15.24 J5.8
D10/RSSI_PWM  (via drill 0.3)
  Top 0.254: J6.6 10.66,20.32 9.78,21.2 9.15,21.2 8.28,22.07 J2.6 | R2.1 28.28,9.27 27.93,8.91 22.76,8.91 20.95,7.11 20.95,4.32 19.79,3.15 v19.76,3.15
  Bottom 0.254: v19.76,3.15 16.54,3.15 14.99,4.7 14.99,10.67 14.35,11.3 14.35,17.4 J6.6
D11/SDA
  Top 0.254: J2.7 8.51,20.7 J6.7 13.59,15.62 13.59,11.26 14.61,10.25 R14.1 16.6,10.25 17.4,9.45 17.4,6.99 18.28,6.11 J4.3
D12/SPI_POCI
  Top 0.254: J2.4 10.13,26.7 J6.4
D13/TXO
  Top 0.254: J2.2 11.21,30.7 J6.2
D14/RXI
  Top 0.254: J6.3 10.67,28.7 J2.3
EN  (via drill 0.3)
  Top 0.254: U2.2 16.51,14.19 15.79,13.46 R3.1 15.66,12.45 16.04,12.06 v20.19,12.06
  Bottom 0.254: J1.1 21.84,7.62 20.45,9.02 20.45,11.81 v20.19,12.06
GND  (via drill 0.3)
  Top 0.152: 2.54,25.65 2.45,25.65
  other vias: 20.73,19.2 22.22,19.18 18.41,16.51 6.35,14.73 25.65,12.83 1.27,6.35 10.16,1.27 17.78,2.54 25.4,1.27 0.64,26.54 0.64,28.07 0.64,32.77 0.64,29.59 0.64,31.11 20.32,16.51 22.22,17.91 22.22,16.51 26.54,5.71 22.91,8.23 18.41,17.91 0.64,24.89 34.29,33.02 34.29,22.86 30.89,15.9 34.29,15.24 1.27,15.24 1.27,22.86 21.08,12.06 31.72,10.92 34.42,14.1 32.51,10.79 32.28,13.49 17.78,33.02 31.65,7.57 22.83,9.5 6.35,31.75 6.35,26.67 6.35,19.05 6.35,22.86 29.21,31.75 29.21,29.21 29.21,24.13 29.21,21.59 29.21,17.78 25.4,31.75 10.16,31.75 17.78,29.21 17.78,26.67 22.86,29.21 22.86,26.67 12.7,29.21 12.7,26.67 12.7,21.59 12.7,13.97 6.35,10.16 25.53,9.6 22.3,20.37 20.73,20.37 12.7,24.13 17.14,16.51
  pour Top (isolate 0.127, rank 3): 0,0 35.56,0 35.56,34.29 0,34.29
  pour Bottom (isolate 0.127, rank 3): 0,0 35.56,0 35.56,34.29 0,34.29
  pour Route2 (isolate 0.127, rank 3): 0,0 35.56,0 35.56,34.29 0,34.29
  pour Top (isolate 0.305, no thermals): 1.52,26.16 2.41,26.16 2.92,25.65 2.41,25.15 1.52,25.15
N$1
  Top 0.254: U2.6 14.8,17.89 14.48,18.2 C3.1
N$2
  Top 0.254: R2.2 D4.A
N$3  (via drill 0.3)
  Top 0.254: v34.52,10.21 34.28,9.97 D4.C
  Bottom 0.254: v34.52,10.21 34.52,9.75 34.04,9.27 RLED.2
N$7
  Top 0.254: R11.2 D2.A
N$8
  pour Top (isolate 0.305, no thermals): 16.89,17.27 16.89,19.05 18.8,19.05 18.8,20.57 13.21,20.57 13.21,19.05 16.13,19.05 16.13,17.27
N$11  (via drill 0.3)
  Top 0.254: R14.2 16.51,7.79 16,7.28 v16,7.11
  Bottom 0.254: I2C_PU.3 16.61,7.11 v16,7.11
N$12
  Top 0.254: R12.2 D3.A
N$13  (via drill 0.3)
  Top 0.254: R15.2 19.05,7.75 19.56,7.24 v19.56,7.11
  Bottom 0.254: v19.56,7.11 18.95,7.11 I2C_PU.1
N$21  (via drill 0.3)
  Top 0.254: v34.42,13.34 34.28,13.2 D3.C
  Bottom 0.254: v34.42,13.34 34.42,12.57 34.16,12.32 ALED.2
N$23  (via drill 0.3)
  Top 0.254: D2.C 34.28,6.97 v34.54,7.24
  Bottom 0.254: PLED.2 34.04,6.22 34.54,6.73 v34.54,7.24
VIN  (via drill 0.3)
  Route15 0.762: J3.1 11.81,7.62 v18.29,14.1 18.41,14.1 v18.8,14.48
  pour Top (no thermals): 16.89,12.95 16.89,14.1 17.27,14.48 17.27,15.75 21.59,15.75 21.59,13.84 20.7,12.95

### Text on the board
Top: 1
Route2: 2
Route15: 3
Bottom: 4 | v10
Measures: Units in Inches
tDocu: Four Layer Board | 1.6mm Thickness | Lead Free HASL | Elias Santistevan